# Altium schematic sheet relay.SchDoc
size A4
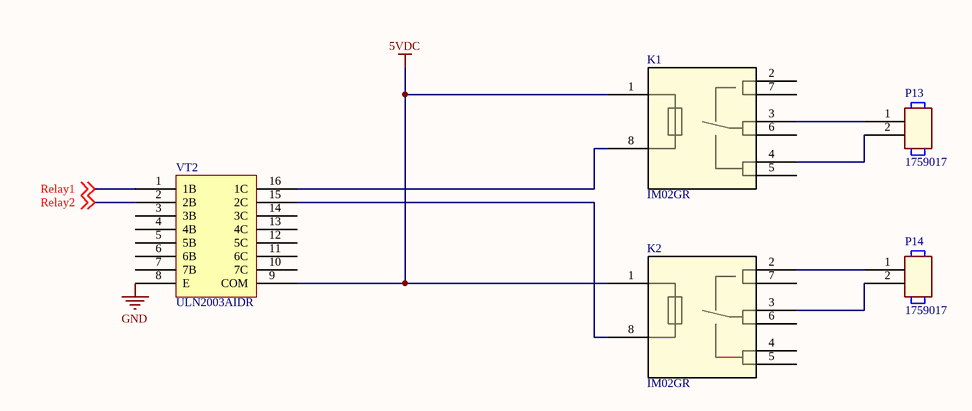
[diagram p0: relay.SchDoc]

## Parts
K1  IM02GR  [IM-Gull]
K2  IM02GR  [IM-Gull]
P13  P/N2: 1759017  [TE_282814-2]  (hidden comment: TE_282814-2)
P14  P/N2: 1759017  [TE_282814-2]  (hidden comment: TE_282814-2)
VT2  P/N: ULN2003AIDR  [SO-G16]  (hidden comment: ULN2003A)

## Nets
5VDC: K1.1(C+) K2.1(C+) VT2.9(COM)
GND: VT2.8(E)
Relay1: VT2.1(1B) ; off-sheet Relay1
Relay2: VT2.2(2B) ; off-sheet Relay2
NetK1_3: K1.3(S1) P13.1
NetK1_4: K1.4(A1) P13.2
NetK1_8: K1.8(C-) VT2.16(1C)
NetK2_2: K2.2(I1) P14.1
NetK2_3: K2.3(S1) P14.2
NetK2_8: K2.8(C-) VT2.15(2C)

Not connected (* = marked no-connect by the designer): K1 2(I1) 5(A2) 6(S2) 7(I2); K2 4(A1) 5(A2) 6(S2) 7(I2); VT2 3(3B) 4(4B) 5(5B) 6(6B) 7(7B) 10(7C) 11(6C) 12(5C) 13(4C) 14(3C)

## Library data of the parts
K1 K2 = IM02GR: Signal Relay; Coil Voltage VDC Nom:4.5V; P/N: IM02GR
P13 P14 = TE_282814-2: Terminal Block Connectors; Manufacturer: TE Connectivity; P/N: 282814-2
VT2 = ULN2003A: DARLINGTON TRANSISTOR ARRAYS; Manufacturer: TI